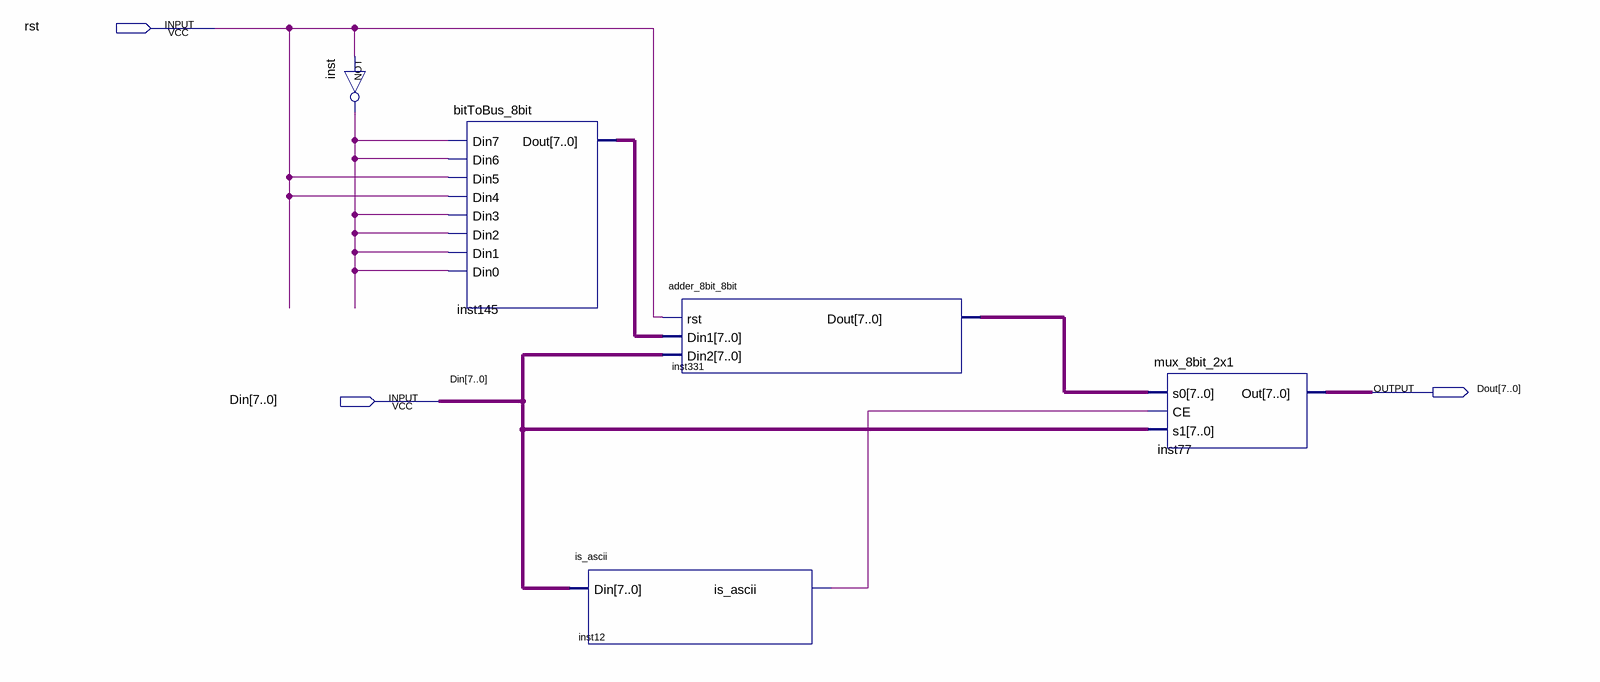
[diagram p0: schematic sheet]
// Quartus schematic CONVERT_TO_ASCII.bdf as structural Verilog: 5 symbols, 3 pins
module CONVERT_TO_ASCII (
  input  rst,
  input  [7:0] Din,
  output [7:0] Dout
);

  wire inst12_is_ascii, inst_out;
  wire [7:0] inst145_dout, inst331_dout;

  not inst (inst_out, rst);
  bitToBus_8bit inst145 (
    .Din7(inst_out), .Din6(inst_out), .Din5(rst), .Din4(rst), .Din3(inst_out), .Din2(inst_out),
    .Din1(inst_out), .Din0(inst_out), .Dout(inst145_dout));
  is_ascii inst12 (.Din(Din), .is_ascii(inst12_is_ascii));
  adder_8bit_8bit inst331 (.rst(rst), .Din1(inst145_dout), .Din2(Din), .Dout(inst331_dout));
  mux_8bit_2x1 inst77 (.s0(inst331_dout), .CE(inst12_is_ascii), .s1(Din), .Out(Dout));
endmodule
